# Altium schematic sheet Misc.SchDoc: Misc
size A4
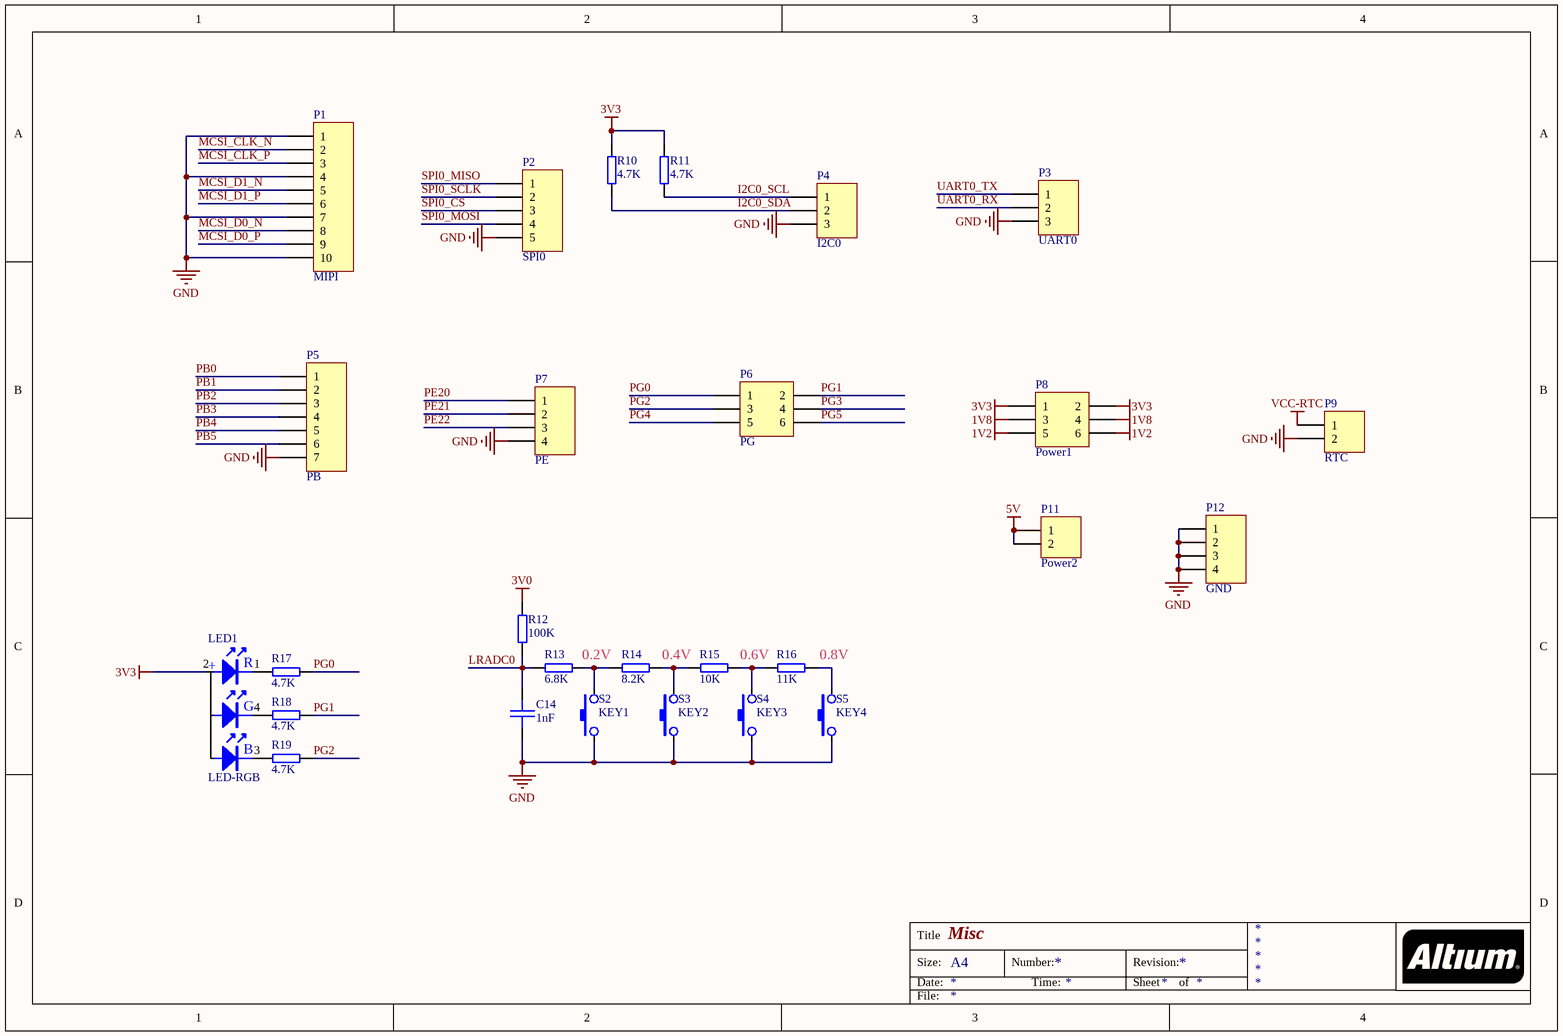
[diagram p0: Misc.SchDoc]

## Parts
C14  1nF  [CAP-0603]
LED1  LED-RGB  [LED-RGB-3528]
P1  MIPI  [HDR1X10]
P2  SPI0  [HDR1X5]
P3  UART0  [HDR1X3]
P4  I2C0  [HDR1X3]
P5  PB  [HDR1X7]
P6  PG  [HDR2X3]
P7  PE  [HDR1X4]
P8  Power1  [HDR2X3]
P9  RTC  [HDR1X2]
P11  Power2  [HDR1X2]
P12  GND  [HDR1X4]
R10  4.7K  [RES-0603]
R11  4.7K  [RES-0603]
R12  100K  [RES-0603]
R13  6.8K  [RES-0603]
R14  8.2K  [RES-0603]
R15  10K  [RES-0603]
R16  11K  [RES-0603]
R17  4.7K  [RES-0603]
R18  4.7K  [RES-0603]
R19  4.7K  [RES-0603]
S2  KEY1  [KEY_3X4X2]
S3  KEY2  [KEY_3X4X2]
S4  KEY3  [KEY_3X4X2]
S5  KEY4  [KEY_3X4X2]

## Nets
1V2: P8.5 P8.6
1V8: P8.3 P8.4
3V0: R12.2
3V3: LED1.2(+) P8.1 P8.2 R10.2 R11.2
5V: P11.1 P11.2
GND: C14.2 P1.1 P1.4 P1.7 P1.10 P2.5 P3.3 P4.3 P5.7 P7.4 P9.2 P12.1 P12.2 P12.3 P12.4 S2.1 S3.1 S4.1 S5.1
VCC-RTC: P9.1
I2C0_SCL: P4.1 R11.1
I2C0_SDA: P4.2 R10.1
LRADC0: C14.1 R12.1 R13.2
MCSI_CLK_N: P1.2
MCSI_CLK_P: P1.3
MCSI_D0_N: P1.8
MCSI_D0_P: P1.9
MCSI_D1_N: P1.5
MCSI_D1_P: P1.6
PB0: P5.1
PB1: P5.2
PB2: P5.3
PB3: P5.4
PB4: P5.5
PB5: P5.6
PE20: P7.1
PE21: P7.2
PE22: P7.3
PG0: P6.1 R17.2
PG1: P6.2 R18.2
PG2: P6.3 R19.2
PG3: P6.4
PG4: P6.5
PG5: P6.6
SPI0_CS: P2.3
SPI0_MISO: P2.1
SPI0_MOSI: P2.4
SPI0_SCLK: P2.2
UART0_RX: P3.2
UART0_TX: P3.1
NetLED1_1: LED1.1(R) R17.1
NetLED1_3: LED1.3(B) R19.1
NetLED1_4: LED1.4(G) R18.1
NetR13_1: R13.1 R14.2 S2.2
NetR14_1: R14.1 R15.2 S3.2
NetR15_1: R15.1 R16.2 S4.2
NetR16_1: R16.1 S5.2

## Notes on the sheet
- 0.2V
- 0.4V
- 0.6V
- (near R16) 0.8V
- Title
- Size:
- Date:
- A4
- Number:
- Time:
- Revision:
- Sheet
- of
- File:

## Library data of the parts
C14 = C_0603: 陶瓷贴片电容0603; tolerance: 10%; voltage: 50V; ESR: 1.73mOhm; IRMS: 5.59A; C_value: 1nF; Series: X7R
LED1 = LED-RGB: RGB发光二极管
P1 = Header 10: Header, 10-Pin; LatestRevisionDate: 17-Jul-2002; LatestRevisionNote: Re-released for DXP Platform.; Publisher: Altium Limited
P2 = Header 5: Header, 5-Pin; LatestRevisionDate: 17-Jul-2002; LatestRevisionNote: Re-released for DXP Platform.; Publisher: Altium Limited
P3 P4 = Header 3: Header, 3-Pin; LatestRevisionDate: 17-Jul-2002; LatestRevisionNote: Re-released for DXP Platform.; Publisher: Altium Limited
P5 = Header 7: Header, 7-Pin; LatestRevisionDate: 17-Jul-2002; LatestRevisionNote: Re-released for DXP Platform.; Publisher: Altium Limited
P6 P8 = Header 3X2: Header, 3-Pin, Dual row; LatestRevisionDate: 17-Jul-2002; LatestRevisionNote: Re-released for DXP Platform.; Publisher: Altium Limited
P7 P12 = Header 4: Header, 4-Pin; LatestRevisionDate: 17-Jul-2002; LatestRevisionNote: Re-released for DXP Platform.; Publisher: Altium Limited
P9 P11 = Header 2: Header, 2-Pin; LatestRevisionDate: 17-Jul-2002; LatestRevisionNote: Re-released for DXP Platform.; Publisher: Altium Limited
R10-R19 = R_0603: 贴片电阻0603; tolerance: 5%; voltage: 50V; power: 0.063W
  R10 R11 R17-R19: R_value: 4.7K
  R12: R_value: 100K
  R13: R_value: 6.8K
  R14: R_value: 8.2K
  R15: R_value: 10K
  R16: R_value: 11K
S2-S5 = KEY: 轻触开关3X4X2